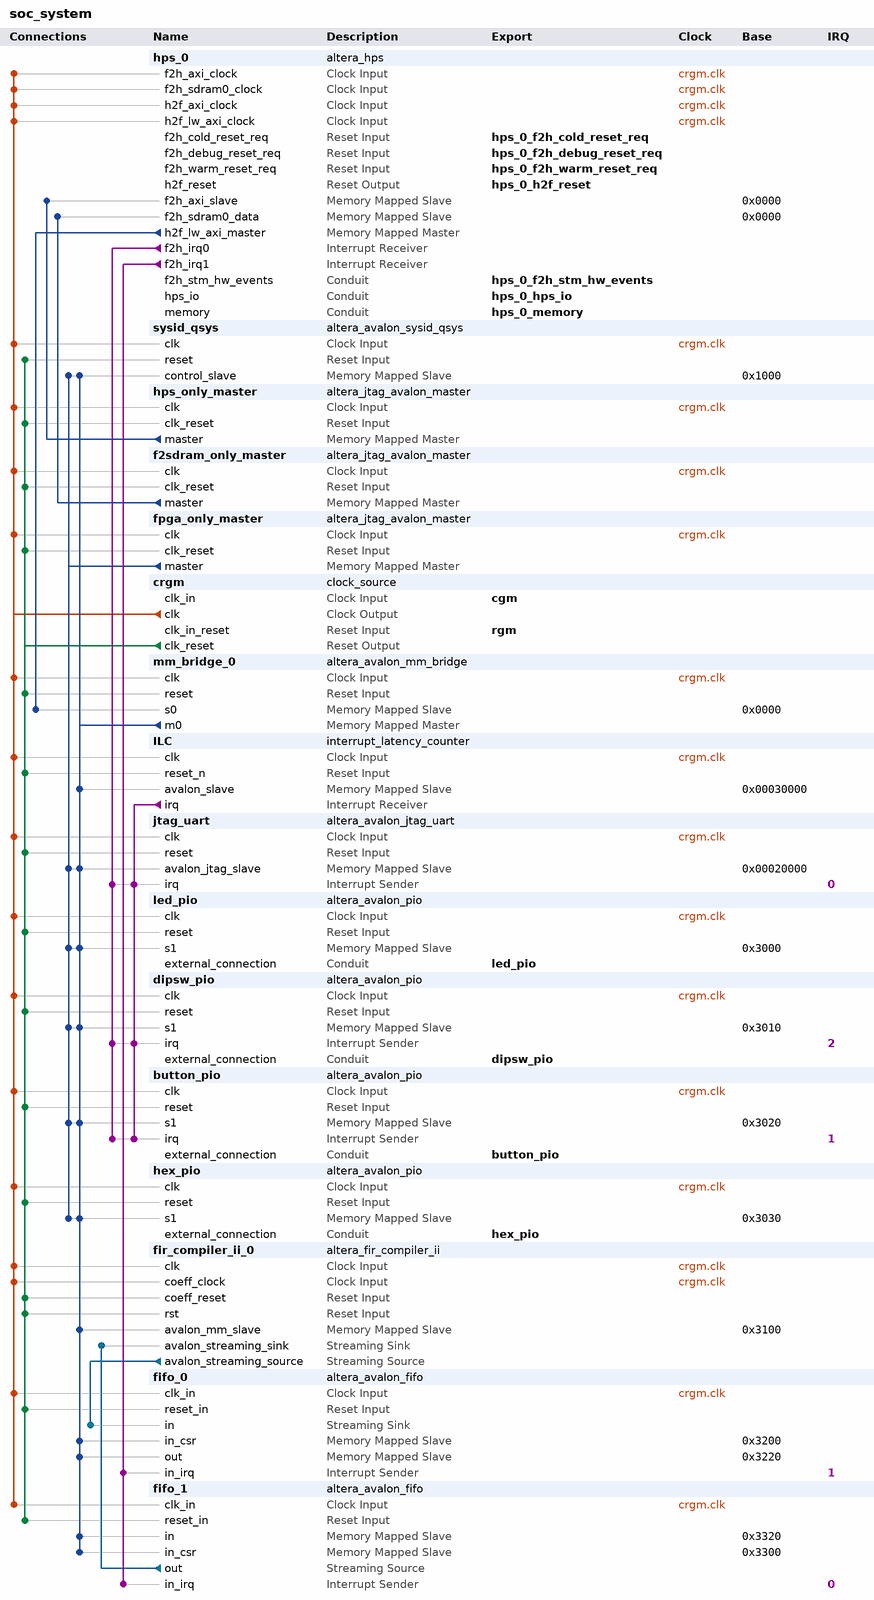
[diagram p0: system contents]
# Platform Designer (Qsys) system soc_system, Cyclone V 5CSXFC6D6F31C6
# Parameters at their usual value, and those the tool derives, are not listed.
package require -exact qsys 24.1
create_system soc_system
set_project_property DEVICE_FAMILY {Cyclone V}
set_project_property DEVICE 5CSXFC6D6F31C6

add_instance hps_0 altera_hps 24.1
set_instance_parameter_value hps_0 EMAC1_Mode RGMII
set_instance_parameter_value hps_0 EMAC1_PinMuxing {HPS I/O Set 0}
set_instance_parameter_value hps_0 F2SCLK_COLDRST_Enable true
set_instance_parameter_value hps_0 F2SCLK_DBGRST_Enable true
set_instance_parameter_value hps_0 F2SCLK_WARMRST_Enable true
set_instance_parameter_value hps_0 F2SDRAM_Type {Avalon-MM Bidirectional}
set_instance_parameter_value hps_0 F2SDRAM_Width 256
set_instance_parameter_value hps_0 F2SINTERRUPT_Enable true
set_instance_parameter_value hps_0 F2S_Width 2
set_instance_parameter_value hps_0 FPGA_PERIPHERAL_OUTPUT_CLOCK_FREQ_EMAC0_GTX_CLK 100
set_instance_parameter_value hps_0 FPGA_PERIPHERAL_OUTPUT_CLOCK_FREQ_EMAC0_MD_CLK 100.0
set_instance_parameter_value hps_0 FPGA_PERIPHERAL_OUTPUT_CLOCK_FREQ_EMAC1_GTX_CLK 100
set_instance_parameter_value hps_0 FPGA_PERIPHERAL_OUTPUT_CLOCK_FREQ_EMAC1_MD_CLK 100.0
set_instance_parameter_value hps_0 HPS_PROTOCOL DDR3
set_instance_parameter_value hps_0 I2C0_Mode I2C
set_instance_parameter_value hps_0 I2C0_PinMuxing {HPS I/O Set 0}
set_instance_parameter_value hps_0 I2C1_Mode I2C
set_instance_parameter_value hps_0 I2C1_PinMuxing {HPS I/O Set 0}
set_instance_parameter_value hps_0 LWH2F_Enable true
set_instance_parameter_value hps_0 MEM_BANKADDR_WIDTH 3
set_instance_parameter_value hps_0 MEM_CLK_FREQ 400.0
set_instance_parameter_value hps_0 MEM_COL_ADDR_WIDTH 10
set_instance_parameter_value hps_0 MEM_DQ_WIDTH 32
set_instance_parameter_value hps_0 MEM_DRV_STR RZQ/6
set_instance_parameter_value hps_0 MEM_ROW_ADDR_WIDTH 15
set_instance_parameter_value hps_0 MEM_RTT_NOM RZQ/6
set_instance_parameter_value hps_0 MEM_RTT_WR {Dynamic ODT off}
set_instance_parameter_value hps_0 MEM_TCL 11
set_instance_parameter_value hps_0 MEM_TFAW_NS 45.0
set_instance_parameter_value hps_0 MEM_TRAS_NS 35.0
set_instance_parameter_value hps_0 MEM_TRCD_NS 13.75
set_instance_parameter_value hps_0 MEM_TRFC_NS 260.0
set_instance_parameter_value hps_0 MEM_TRP_NS 13.75
set_instance_parameter_value hps_0 MEM_VENDOR Micron
set_instance_parameter_value hps_0 MEM_WTCL 7
set_instance_parameter_value hps_0 QSPI_Mode {1 SS}
set_instance_parameter_value hps_0 QSPI_PinMuxing {HPS I/O Set 0}
set_instance_parameter_value hps_0 REF_CLK_FREQ 25.0
set_instance_parameter_value hps_0 S2FCLK_USER2CLK 5
set_instance_parameter_value hps_0 S2F_Width 2
set_instance_parameter_value hps_0 SDIO_Mode {4-bit Data}
set_instance_parameter_value hps_0 SDIO_PinMuxing {HPS I/O Set 0}
set_instance_parameter_value hps_0 SPIM0_Mode {Single Slave Select}
set_instance_parameter_value hps_0 SPIM0_PinMuxing {HPS I/O Set 0}
set_instance_parameter_value hps_0 SPIM1_Mode {Single Slave Select}
set_instance_parameter_value hps_0 SPIM1_PinMuxing {HPS I/O Set 0}
set_instance_parameter_value hps_0 STM_Enable true
set_instance_parameter_value hps_0 TIMING_BOARD_AC_SKEW 0.02
set_instance_parameter_value hps_0 TIMING_BOARD_AC_TO_CK_SKEW 0.01
set_instance_parameter_value hps_0 TIMING_BOARD_DQ_TO_DQS_SKEW 0.05
set_instance_parameter_value hps_0 TIMING_BOARD_MAX_CK_DELAY 0.03
set_instance_parameter_value hps_0 TIMING_BOARD_MAX_DQS_DELAY 0.02
set_instance_parameter_value hps_0 TIMING_BOARD_SKEW_BETWEEN_DQS 0.06
set_instance_parameter_value hps_0 TIMING_BOARD_SKEW_CKDQS_DIMM_MAX 0.12
set_instance_parameter_value hps_0 TIMING_BOARD_SKEW_CKDQS_DIMM_MIN 0.06
set_instance_parameter_value hps_0 TIMING_BOARD_SKEW_WITHIN_DQS 0.01
set_instance_parameter_value hps_0 TIMING_TDH 65
set_instance_parameter_value hps_0 TIMING_TDQSCK 255
set_instance_parameter_value hps_0 TIMING_TDQSQ 125
set_instance_parameter_value hps_0 TIMING_TDS 30
set_instance_parameter_value hps_0 TIMING_TIH 140
set_instance_parameter_value hps_0 TIMING_TIS 190
set_instance_parameter_value hps_0 TIMING_TQSH 0.4
set_instance_parameter_value hps_0 UART0_Mode {No Flow Control}
set_instance_parameter_value hps_0 UART0_PinMuxing {HPS I/O Set 0}
set_instance_parameter_value hps_0 USB1_Mode SDR
set_instance_parameter_value hps_0 USB1_PinMuxing {HPS I/O Set 0}
set_instance_parameter_value hps_0 desired_cfg_clk_mhz 100.0
set_instance_parameter_value hps_0 desired_qspi_clk_mhz 400.0

add_instance sysid_qsys altera_avalon_sysid_qsys 24.1
set_instance_parameter_value sysid_qsys id -1395322110

add_instance hps_only_master altera_jtag_avalon_master 24.1

add_instance f2sdram_only_master altera_jtag_avalon_master 24.1

add_instance fpga_only_master altera_jtag_avalon_master 24.1

add_instance crgm clock_source 24.1
set_instance_parameter_value crgm clockFrequency 50000000

add_instance mm_bridge_0 altera_avalon_mm_bridge 24.1
set_instance_parameter_value mm_bridge_0 ADDRESS_UNITS SYMBOLS
set_instance_parameter_value mm_bridge_0 ADDRESS_WIDTH 10
set_instance_parameter_value mm_bridge_0 DATA_WIDTH 32
set_instance_parameter_value mm_bridge_0 MAX_PENDING_RESPONSES 4
set_instance_parameter_value mm_bridge_0 USE_AUTO_ADDRESS_WIDTH 1

add_instance ILC interrupt_latency_counter 24.1

add_instance jtag_uart altera_avalon_jtag_uart 24.1
set_instance_parameter_value jtag_uart allowMultipleConnections true
set_instance_parameter_value jtag_uart simInteractiveOptions INTERACTIVE_ASCII_OUTPUT

add_instance led_pio altera_avalon_pio 24.1
set_instance_parameter_value led_pio direction Output
set_instance_parameter_value led_pio width 10

add_instance dipsw_pio altera_avalon_pio 24.1
set_instance_parameter_value dipsw_pio bitClearingEdgeCapReg true
set_instance_parameter_value dipsw_pio captureEdge true
set_instance_parameter_value dipsw_pio direction Input
set_instance_parameter_value dipsw_pio edgeType ANY
set_instance_parameter_value dipsw_pio generateIRQ true
set_instance_parameter_value dipsw_pio irqType EDGE
set_instance_parameter_value dipsw_pio width 10

add_instance button_pio altera_avalon_pio 24.1
set_instance_parameter_value button_pio bitClearingEdgeCapReg true
set_instance_parameter_value button_pio captureEdge true
set_instance_parameter_value button_pio direction Input
set_instance_parameter_value button_pio edgeType FALLING
set_instance_parameter_value button_pio generateIRQ true
set_instance_parameter_value button_pio irqType EDGE
set_instance_parameter_value button_pio width 4

add_instance hex_pio altera_avalon_pio 24.1
set_instance_parameter_value hex_pio direction Output
set_instance_parameter_value hex_pio width 24

add_instance fir_compiler_ii_0 altera_fir_compiler_ii 24.1
set_instance_parameter_value fir_compiler_ii_0 coeffBitWidth 20
set_instance_parameter_value fir_compiler_ii_0 coeffFracBitWidth 19
set_instance_parameter_value fir_compiler_ii_0 coeffReload true
set_instance_parameter_value fir_compiler_ii_0 coeffType frac
set_instance_parameter_value fir_compiler_ii_0 inputBitWidth 20
set_instance_parameter_value fir_compiler_ii_0 inputChannelNum 1
set_instance_parameter_value fir_compiler_ii_0 inputFracBitWidth 19
set_instance_parameter_value fir_compiler_ii_0 inputRate 1
set_instance_parameter_value fir_compiler_ii_0 inputType frac
set_instance_parameter_value fir_compiler_ii_0 outLSBRound round
set_instance_parameter_value fir_compiler_ii_0 outLsbBitRem 20
set_instance_parameter_value fir_compiler_ii_0 outMsbBitRem 6
set_instance_parameter_value fir_compiler_ii_0 outType frac
set_instance_parameter_value fir_compiler_ii_0 readWriteMode read_write
set_instance_parameter_value fir_compiler_ii_0 speedGrade slow

add_instance fifo_0 altera_avalon_fifo 24.1
set_instance_parameter_value fifo_0 bitsPerSymbol 20
set_instance_parameter_value fifo_0 channelWidth 0
set_instance_parameter_value fifo_0 errorWidth 0
set_instance_parameter_value fifo_0 fifoDepth 128
set_instance_parameter_value fifo_0 fifoInputInterfaceOptions AVALONST_SINK
set_instance_parameter_value fifo_0 fifoOutputInterfaceOptions AVALONMM_READ
set_instance_parameter_value fifo_0 singleClockMode true
set_instance_parameter_value fifo_0 symbolsPerBeat 1
set_instance_parameter_value fifo_0 useIRQ true
set_instance_parameter_value fifo_0 usePacket false
set_instance_parameter_value fifo_0 useReadControl false

add_instance fifo_1 altera_avalon_fifo 24.1
set_instance_parameter_value fifo_1 bitsPerSymbol 20
set_instance_parameter_value fifo_1 channelWidth 0
set_instance_parameter_value fifo_1 errorWidth 0
set_instance_parameter_value fifo_1 fifoDepth 128
set_instance_parameter_value fifo_1 fifoInputInterfaceOptions AVALONMM_WRITE
set_instance_parameter_value fifo_1 fifoOutputInterfaceOptions AVALONST_SOURCE
set_instance_parameter_value fifo_1 singleClockMode true
set_instance_parameter_value fifo_1 symbolsPerBeat 1
set_instance_parameter_value fifo_1 useIRQ true
set_instance_parameter_value fifo_1 usePacket false
set_instance_parameter_value fifo_1 useReadControl false

# connections
add_connection crgm.clk button_pio.clk clock
add_connection crgm.clk dipsw_pio.clk clock
add_connection crgm.clk f2sdram_only_master.clk clock
add_connection crgm.clk fifo_0.clk_in clock
add_connection crgm.clk fifo_1.clk_in clock
add_connection crgm.clk fir_compiler_ii_0.clk clock
add_connection crgm.clk fir_compiler_ii_0.coeff_clock clock
add_connection crgm.clk fpga_only_master.clk clock
add_connection crgm.clk hex_pio.clk clock
add_connection crgm.clk hps_0.f2h_axi_clock clock
add_connection crgm.clk hps_0.f2h_sdram0_clock clock
add_connection crgm.clk hps_0.h2f_axi_clock clock
add_connection crgm.clk hps_0.h2f_lw_axi_clock clock
add_connection crgm.clk hps_only_master.clk clock
add_connection crgm.clk ILC.clk clock
add_connection crgm.clk jtag_uart.clk clock
add_connection crgm.clk led_pio.clk clock
add_connection crgm.clk mm_bridge_0.clk clock
add_connection crgm.clk sysid_qsys.clk clock
add_connection crgm.clk_reset button_pio.reset reset
add_connection crgm.clk_reset dipsw_pio.reset reset
add_connection crgm.clk_reset f2sdram_only_master.clk_reset reset
add_connection crgm.clk_reset fifo_0.reset_in reset
add_connection crgm.clk_reset fifo_1.reset_in reset
add_connection crgm.clk_reset fir_compiler_ii_0.coeff_reset reset
add_connection crgm.clk_reset fir_compiler_ii_0.rst reset
add_connection crgm.clk_reset fpga_only_master.clk_reset reset
add_connection crgm.clk_reset hex_pio.reset reset
add_connection crgm.clk_reset hps_only_master.clk_reset reset
add_connection crgm.clk_reset ILC.reset_n reset
add_connection crgm.clk_reset jtag_uart.reset reset
add_connection crgm.clk_reset led_pio.reset reset
add_connection crgm.clk_reset mm_bridge_0.reset reset
add_connection crgm.clk_reset sysid_qsys.reset reset
add_connection f2sdram_only_master.master hps_0.f2h_sdram0_data avalon
set_connection_parameter_value f2sdram_only_master.master/hps_0.f2h_sdram0_data baseAddress 0x0000
add_connection fpga_only_master.master button_pio.s1 avalon
set_connection_parameter_value fpga_only_master.master/button_pio.s1 baseAddress 0x3020
add_connection fpga_only_master.master dipsw_pio.s1 avalon
set_connection_parameter_value fpga_only_master.master/dipsw_pio.s1 baseAddress 0x3010
add_connection fpga_only_master.master hex_pio.s1 avalon
set_connection_parameter_value fpga_only_master.master/hex_pio.s1 baseAddress 0x3030
add_connection fpga_only_master.master jtag_uart.avalon_jtag_slave avalon
set_connection_parameter_value fpga_only_master.master/jtag_uart.avalon_jtag_slave baseAddress 0x00020000
add_connection fpga_only_master.master led_pio.s1 avalon
set_connection_parameter_value fpga_only_master.master/led_pio.s1 baseAddress 0x3000
add_connection fpga_only_master.master sysid_qsys.control_slave avalon
set_connection_parameter_value fpga_only_master.master/sysid_qsys.control_slave baseAddress 0x1000
add_connection hps_0.h2f_lw_axi_master mm_bridge_0.s0 avalon
set_connection_parameter_value hps_0.h2f_lw_axi_master/mm_bridge_0.s0 baseAddress 0x0000
add_connection hps_only_master.master hps_0.f2h_axi_slave avalon
set_connection_parameter_value hps_only_master.master/hps_0.f2h_axi_slave baseAddress 0x0000
add_connection mm_bridge_0.m0 button_pio.s1 avalon
set_connection_parameter_value mm_bridge_0.m0/button_pio.s1 baseAddress 0x3020
add_connection mm_bridge_0.m0 dipsw_pio.s1 avalon
set_connection_parameter_value mm_bridge_0.m0/dipsw_pio.s1 baseAddress 0x3010
add_connection mm_bridge_0.m0 fifo_0.in_csr avalon
set_connection_parameter_value mm_bridge_0.m0/fifo_0.in_csr baseAddress 0x3200
add_connection mm_bridge_0.m0 fifo_0.out avalon
set_connection_parameter_value mm_bridge_0.m0/fifo_0.out baseAddress 0x3220
add_connection mm_bridge_0.m0 fifo_1.in avalon
set_connection_parameter_value mm_bridge_0.m0/fifo_1.in baseAddress 0x3320
add_connection mm_bridge_0.m0 fifo_1.in_csr avalon
set_connection_parameter_value mm_bridge_0.m0/fifo_1.in_csr baseAddress 0x3300
add_connection mm_bridge_0.m0 fir_compiler_ii_0.avalon_mm_slave avalon
set_connection_parameter_value mm_bridge_0.m0/fir_compiler_ii_0.avalon_mm_slave baseAddress 0x3100
add_connection mm_bridge_0.m0 hex_pio.s1 avalon
set_connection_parameter_value mm_bridge_0.m0/hex_pio.s1 baseAddress 0x3030
add_connection mm_bridge_0.m0 ILC.avalon_slave avalon
set_connection_parameter_value mm_bridge_0.m0/ILC.avalon_slave baseAddress 0x00030000
add_connection mm_bridge_0.m0 jtag_uart.avalon_jtag_slave avalon
set_connection_parameter_value mm_bridge_0.m0/jtag_uart.avalon_jtag_slave baseAddress 0x00020000
add_connection mm_bridge_0.m0 led_pio.s1 avalon
set_connection_parameter_value mm_bridge_0.m0/led_pio.s1 baseAddress 0x3000
add_connection mm_bridge_0.m0 sysid_qsys.control_slave avalon
set_connection_parameter_value mm_bridge_0.m0/sysid_qsys.control_slave baseAddress 0x1000
add_connection fifo_1.out fir_compiler_ii_0.avalon_streaming_sink avalon_streaming
add_connection fir_compiler_ii_0.avalon_streaming_source fifo_0.in avalon_streaming
add_connection hps_0.f2h_irq0 button_pio.irq interrupt
set_connection_parameter_value hps_0.f2h_irq0/button_pio.irq irqNumber 1
add_connection hps_0.f2h_irq0 dipsw_pio.irq interrupt
set_connection_parameter_value hps_0.f2h_irq0/dipsw_pio.irq irqNumber 0
add_connection hps_0.f2h_irq0 jtag_uart.irq interrupt
set_connection_parameter_value hps_0.f2h_irq0/jtag_uart.irq irqNumber 2
add_connection hps_0.f2h_irq1 fifo_0.in_irq interrupt
set_connection_parameter_value hps_0.f2h_irq1/fifo_0.in_irq irqNumber 1
add_connection hps_0.f2h_irq1 fifo_1.in_irq interrupt
set_connection_parameter_value hps_0.f2h_irq1/fifo_1.in_irq irqNumber 0
add_connection ILC.irq button_pio.irq interrupt
set_connection_parameter_value ILC.irq/button_pio.irq irqNumber 1
add_connection ILC.irq dipsw_pio.irq interrupt
set_connection_parameter_value ILC.irq/dipsw_pio.irq irqNumber 2
add_connection ILC.irq jtag_uart.irq interrupt
set_connection_parameter_value ILC.irq/jtag_uart.irq irqNumber 0

# exported interfaces
add_interface button_pio conduit end
set_interface_property button_pio EXPORT_OF button_pio.external_connection
add_interface cgm clock sink
set_interface_property cgm EXPORT_OF crgm.clk_in
add_interface dipsw_pio conduit end
set_interface_property dipsw_pio EXPORT_OF dipsw_pio.external_connection
add_interface hex_pio conduit end
set_interface_property hex_pio EXPORT_OF hex_pio.external_connection
add_interface hps_0_f2h_cold_reset_req reset sink
set_interface_property hps_0_f2h_cold_reset_req EXPORT_OF hps_0.f2h_cold_reset_req
add_interface hps_0_f2h_debug_reset_req reset sink
set_interface_property hps_0_f2h_debug_reset_req EXPORT_OF hps_0.f2h_debug_reset_req
add_interface hps_0_f2h_stm_hw_events conduit end
set_interface_property hps_0_f2h_stm_hw_events EXPORT_OF hps_0.f2h_stm_hw_events
add_interface hps_0_f2h_warm_reset_req reset sink
set_interface_property hps_0_f2h_warm_reset_req EXPORT_OF hps_0.f2h_warm_reset_req
add_interface hps_0_h2f_reset reset source
set_interface_property hps_0_h2f_reset EXPORT_OF hps_0.h2f_reset
add_interface hps_0_hps_io conduit end
set_interface_property hps_0_hps_io EXPORT_OF hps_0.hps_io
add_interface hps_0_memory conduit end
set_interface_property hps_0_memory EXPORT_OF hps_0.memory
add_interface led_pio conduit end
set_interface_property led_pio EXPORT_OF led_pio.external_connection
add_interface rgm reset sink
set_interface_property rgm EXPORT_OF crgm.clk_in_reset

set_interconnect_requirement {$system} qsys_mm.clockCrossingAdapter AUTO
set_interconnect_requirement {$system} qsys_mm.maxAdditionalLatency 1
set_interconnect_requirement fpga_only_master.master qsys_mm.security NON_SECURE
set_interconnect_requirement hps_0.f2h_sdram0_data qsys_mm.security NON_SECURE
set_interconnect_requirement hps_only_master.master qsys_mm.security NON_SECURE

save_system soc_system.qsys
